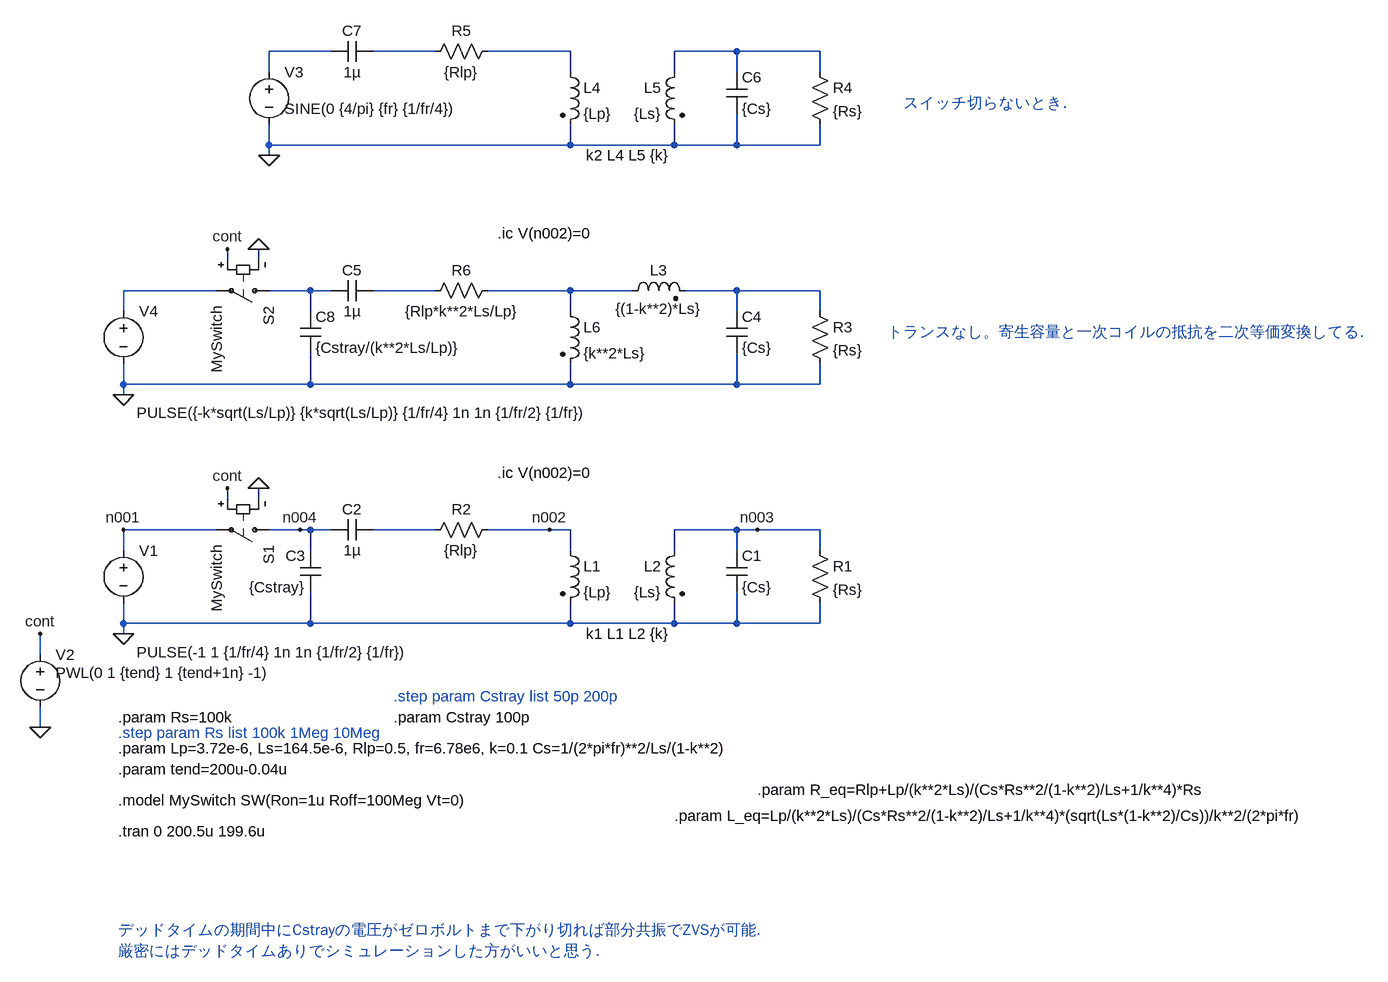
[diagram p0: schematic tesla_HFSSTC_ZVS_condition_v1.asc]
tesla_HFSSTC_ZVS_condition_v1.asc, the LTspice schematic file:
Version 4
SHEET 1 1144 680
WIRE -592 -736 -688 -736
WIRE -432 -736 -528 -736
WIRE -224 -736 -352 -736
WIRE 32 -736 -64 -736
WIRE 160 -736 32 -736
WIRE -688 -704 -688 -736
WIRE -224 -704 -224 -736
WIRE -64 -704 -64 -736
WIRE 32 -704 32 -736
WIRE 160 -704 160 -736
WIRE -688 -592 -688 -624
WIRE -224 -592 -224 -624
WIRE -224 -592 -688 -592
WIRE -64 -592 -64 -624
WIRE -64 -592 -224 -592
WIRE 32 -592 32 -640
WIRE 32 -592 -64 -592
WIRE 160 -592 160 -624
WIRE 160 -592 32 -592
WIRE -688 -576 -688 -592
WIRE -752 -416 -752 -432
WIRE -704 -416 -704 -432
WIRE -768 -368 -912 -368
WIRE -624 -368 -688 -368
WIRE -592 -368 -624 -368
WIRE -432 -368 -528 -368
WIRE -224 -368 -352 -368
WIRE -128 -368 -224 -368
WIRE 32 -368 -48 -368
WIRE 160 -368 32 -368
WIRE -912 -336 -912 -368
WIRE -624 -336 -624 -368
WIRE -224 -336 -224 -368
WIRE 32 -336 32 -368
WIRE 160 -336 160 -368
WIRE -912 -224 -912 -256
WIRE -624 -224 -624 -272
WIRE -624 -224 -912 -224
WIRE -224 -224 -224 -256
WIRE -224 -224 -624 -224
WIRE 32 -224 32 -272
WIRE 32 -224 -224 -224
WIRE 160 -224 160 -256
WIRE 160 -224 32 -224
WIRE -912 -208 -912 -224
WIRE -752 -48 -752 -64
WIRE -704 -48 -704 -64
WIRE -768 0 -912 0
WIRE -640 0 -688 0
WIRE -624 0 -640 0
WIRE -592 0 -624 0
WIRE -432 0 -528 0
WIRE -256 0 -352 0
WIRE -224 0 -256 0
WIRE 32 0 -64 0
WIRE 64 0 32 0
WIRE 160 0 64 0
WIRE -912 32 -912 0
WIRE -624 32 -624 0
WIRE -224 32 -224 0
WIRE -64 32 -64 0
WIRE 32 32 32 0
WIRE 160 32 160 0
WIRE -912 144 -912 112
WIRE -624 144 -624 96
WIRE -624 144 -912 144
WIRE -224 144 -224 112
WIRE -224 144 -624 144
WIRE -64 144 -64 112
WIRE -64 144 -224 144
WIRE 32 144 32 96
WIRE 32 144 -64 144
WIRE 160 144 160 112
WIRE 160 144 32 144
WIRE -912 160 -912 144
WIRE -1040 192 -1040 160
WIRE -1040 304 -1040 272
FLAG -912 160 0
FLAG -256 0 n002
FLAG -912 0 n001
FLAG 64 0 n003
FLAG -704 -64 0
FLAG -752 -64 cont
FLAG -1040 304 0
FLAG -1040 160 cont
FLAG -640 0 n004
FLAG -688 -576 0
FLAG -912 -208 0
FLAG -704 -432 0
FLAG -752 -432 cont
SYMBOL ind2 -240 16 R0
SYMATTR InstName L1
SYMATTR Value {Lp}
SYMATTR Type ind
SYMBOL voltage -912 16 R0
WINDOW 3 20 172 Left 2
WINDOW 123 24 124 Left 2
WINDOW 39 0 0 Left 0
SYMATTR Value PULSE(-1 1 {1/fr/4} 1n 1n {1/fr/2} {1/fr})
SYMATTR InstName V1
SYMBOL res 144 16 R0
SYMATTR InstName R1
SYMATTR Value {Rs}
SYMBOL res -448 16 R270
WINDOW 0 32 56 VTop 2
WINDOW 3 0 56 VBottom 2
SYMATTR InstName R2
SYMATTR Value {Rlp}
SYMBOL ind2 -48 16 M0
SYMATTR InstName L2
SYMATTR Value {Ls}
SYMATTR Type ind
SYMBOL cap 16 32 R0
SYMATTR InstName C1
SYMATTR Value {Cs}
SYMBOL sw -672 0 R90
SYMATTR InstName S1
SYMATTR Value MySwitch
SYMBOL voltage -1040 176 R0
WINDOW 3 24 44 Left 2
WINDOW 123 24 124 Left 2
WINDOW 39 0 0 Left 0
SYMATTR Value PWL(0 1 {tend} 1 {tend+1n} -1)
SYMATTR InstName V2
SYMBOL cap -528 -16 R90
WINDOW 0 0 32 VBottom 2
WINDOW 3 32 32 VTop 2
SYMATTR InstName C2
SYMATTR Value 1µ
SYMBOL cap -608 96 R180
WINDOW 0 24 56 Left 2
WINDOW 3 24 8 Left 2
SYMATTR InstName C3
SYMATTR Value {Cstray}
SYMBOL ind2 -240 -720 R0
SYMATTR InstName L4
SYMATTR Value {Lp}
SYMATTR Type ind
SYMBOL res 144 -720 R0
SYMATTR InstName R4
SYMATTR Value {Rs}
SYMBOL res -448 -720 R270
WINDOW 0 32 56 VTop 2
WINDOW 3 0 56 VBottom 2
SYMATTR InstName R5
SYMATTR Value {Rlp}
SYMBOL ind2 -48 -720 M0
SYMATTR InstName L5
SYMATTR Value {Ls}
SYMATTR Type ind
SYMBOL cap 16 -704 R0
SYMATTR InstName C6
SYMATTR Value {Cs}
SYMBOL cap -528 -752 R90
WINDOW 0 0 32 VBottom 2
WINDOW 3 32 32 VTop 2
SYMATTR InstName C7
SYMATTR Value 1µ
SYMBOL voltage -688 -720 R0
WINDOW 3 24 72 Left 2
WINDOW 123 24 44 Left 2
WINDOW 39 0 0 Left 0
SYMATTR Value SINE(0 {4/pi} {fr} {1/fr/4})
SYMATTR InstName V3
SYMBOL voltage -912 -352 R0
WINDOW 3 20 172 Left 2
WINDOW 123 24 124 Left 2
WINDOW 39 0 0 Left 0
SYMATTR Value PULSE({-k*sqrt(Ls/Lp)} {k*sqrt(Ls/Lp)} {1/fr/4} 1n 1n {1/fr/2} {1/fr})
SYMATTR InstName V4
SYMBOL res 144 -352 R0
SYMATTR InstName R3
SYMATTR Value {Rs}
SYMBOL res -448 -352 R270
WINDOW 0 32 56 VTop 2
WINDOW 3 0 56 VBottom 2
SYMATTR InstName R6
SYMATTR Value {Rlp*k**2*Ls/Lp}
SYMBOL ind2 -240 -352 R0
SYMATTR InstName L6
SYMATTR Value {k**2*Ls}
SYMATTR Type ind
SYMBOL cap 16 -336 R0
SYMATTR InstName C4
SYMATTR Value {Cs}
SYMBOL sw -672 -368 R90
SYMATTR InstName S2
SYMATTR Value MySwitch
SYMBOL cap -528 -384 R90
WINDOW 0 0 32 VBottom 2
WINDOW 3 32 32 VTop 2
SYMATTR InstName C5
SYMATTR Value 1µ
SYMBOL cap -640 -272 M180
WINDOW 0 24 56 Left 2
WINDOW 3 24 8 Left 2
SYMATTR InstName C8
SYMATTR Value {Cstray/(k**2*Ls/Lp)}
SYMBOL ind2 -144 -352 R270
WINDOW 0 32 56 VTop 2
WINDOW 3 4 56 VBottom 2
SYMATTR InstName L3
SYMATTR Value {(1-k**2)*Ls}
SYMATTR Type ind
TEXT -200 160 Left 2 !k1 L1 L2 {k}
TEXT -920 464 Left 2 !.tran 0 200.5u 199.6u
TEXT -920 312 Left 2 ;.step param Rs list 100k 1Meg 10Meg
TEXT -920 336 Left 2 !.param Lp=3.72e-6, Ls=164.5e-6, Rlp=0.5, fr=6.78e6, k=0.1 Cs=1/(2*pi*fr)**2/Ls/(1-k**2)
TEXT -336 -88 Left 2 !.ic V(n002)=0
TEXT -920 288 Left 2 !.param Rs=100k
TEXT -920 416 Left 2 !.model MySwitch SW(Ron=1u Roff=100Meg Vt=0)
TEXT -920 368 Left 2 !.param tend=200u-0.04u
TEXT -496 256 Left 2 ;.step param Cstray list 50p 200p
TEXT 64 400 Left 2 !.param R_eq=Rlp+Lp/(k**2*Ls)/(Cs*Rs**2/(1-k**2)/Ls+1/k**4)*Rs
TEXT -64 440 Left 2 !.param L_eq=Lp/(k**2*Ls)/(Cs*Rs**2/(1-k**2)/Ls+1/k**4)*(sqrt(Ls*(1-k**2)/Cs))/k**2/(2*pi*fr)
TEXT -496 288 Left 2 !.param Cstray 100p
TEXT -200 -576 Left 2 !k2 L4 L5 {k}
TEXT -336 -456 Left 2 !.ic V(n002)=0
TEXT 288 -656 Left 2 ;スイッチ切らないとき.
TEXT 264 -304 Left 2 ;トランスなし。寄生容量と一次コイルの抵抗を二次等価変換してる.
TEXT -920 616 Left 2 ;デッドタイムの期間中にCstrayの電圧がゼロボルトまで下がり切れば部分共振でZVSが可能.
TEXT -920 648 Left 2 ;厳密にはデッドタイムありでシミュレーションした方がいいと思う.

The netlist it stands for:
* tesla_HFSSTC_ZVS_condition_v1.asc
L1 n002 0 {Lp}
V1 n001 0 PULSE(-1 1 {1/fr/4} 1n 1n {1/fr/2} {1/fr})
R1 n003 0 {Rs}
R2 N014 n002 {Rlp}
L2 n003 0 {Ls}
C1 n003 0 {Cs}
S1 n004 n001 cont 0 MySwitch
V2 cont 0 PWL(0 1 {tend} 1 {tend+1n} -1)
C2 N014 n004 1µ
C3 0 n004 {Cstray}
L4 N007 0 {Lp}
R4 N008 0 {Rs}
R5 N006 N007 {Rlp}
L5 N008 0 {Ls}
C6 N008 0 {Cs}
C7 N006 N005 1µ
V3 N005 0 SINE(0 {4/pi} {fr} {1/fr/4})
V4 N009 0 PULSE({-k*sqrt(Ls/Lp)} {k*sqrt(Ls/Lp)} {1/fr/4} 1n 1n {1/fr/2} {1/fr})
R3 N013 0 {Rs}
R6 N011 N012 {Rlp*k**2*Ls/Lp}
L6 N012 0 {k**2*Ls}
C4 N013 0 {Cs}
S2 N010 N009 cont 0 MySwitch
C5 N011 N010 1µ
C8 0 N010 {Cstray/(k**2*Ls/Lp)}
L3 N012 N013 {(1-k**2)*Ls}
k1 L1 L2 {k}
.tran 0 200.5u 199.6u
* .step param Rs list 100k 1Meg 10Meg
.param Lp=3.72e-6, Ls=164.5e-6, Rlp=0.5, fr=6.78e6, k=0.1 Cs=1/(2*pi*fr)**2/Ls/(1-k**2)
.ic V(n002)=0
.param Rs=100k
.model MySwitch SW(Ron=1u Roff=100Meg Vt=0)
.param tend=200u-0.04u
* .step param Cstray list 50p 200p
.param R_eq=Rlp+Lp/(k**2*Ls)/(Cs*Rs**2/(1-k**2)/Ls+1/k**4)*Rs
.param L_eq=Lp/(k**2*Ls)/(Cs*Rs**2/(1-k**2)/Ls+1/k**4)*(sqrt(Ls*(1-k**2)/Cs))/k**2/(2*pi*fr)
.param Cstray 100p
k2 L4 L5 {k}
.ic V(n002)=0
* スイッチ切らないとき.
* トランスなし。寄生容量と一次コイルの抵抗を二次等価変換してる.
* デッドタイムの期間中にCstrayの電圧がゼロボルトまで下がり切れば部分共振でZVSが可能.
* 厳密にはデッドタイムありでシミュレーションした方がいいと思う.
.backanno
.end